# EAGLE design ivo_A_v1_1 (EAGLE 9.6.2)

## Sheet 1 of 3: Audio I/O
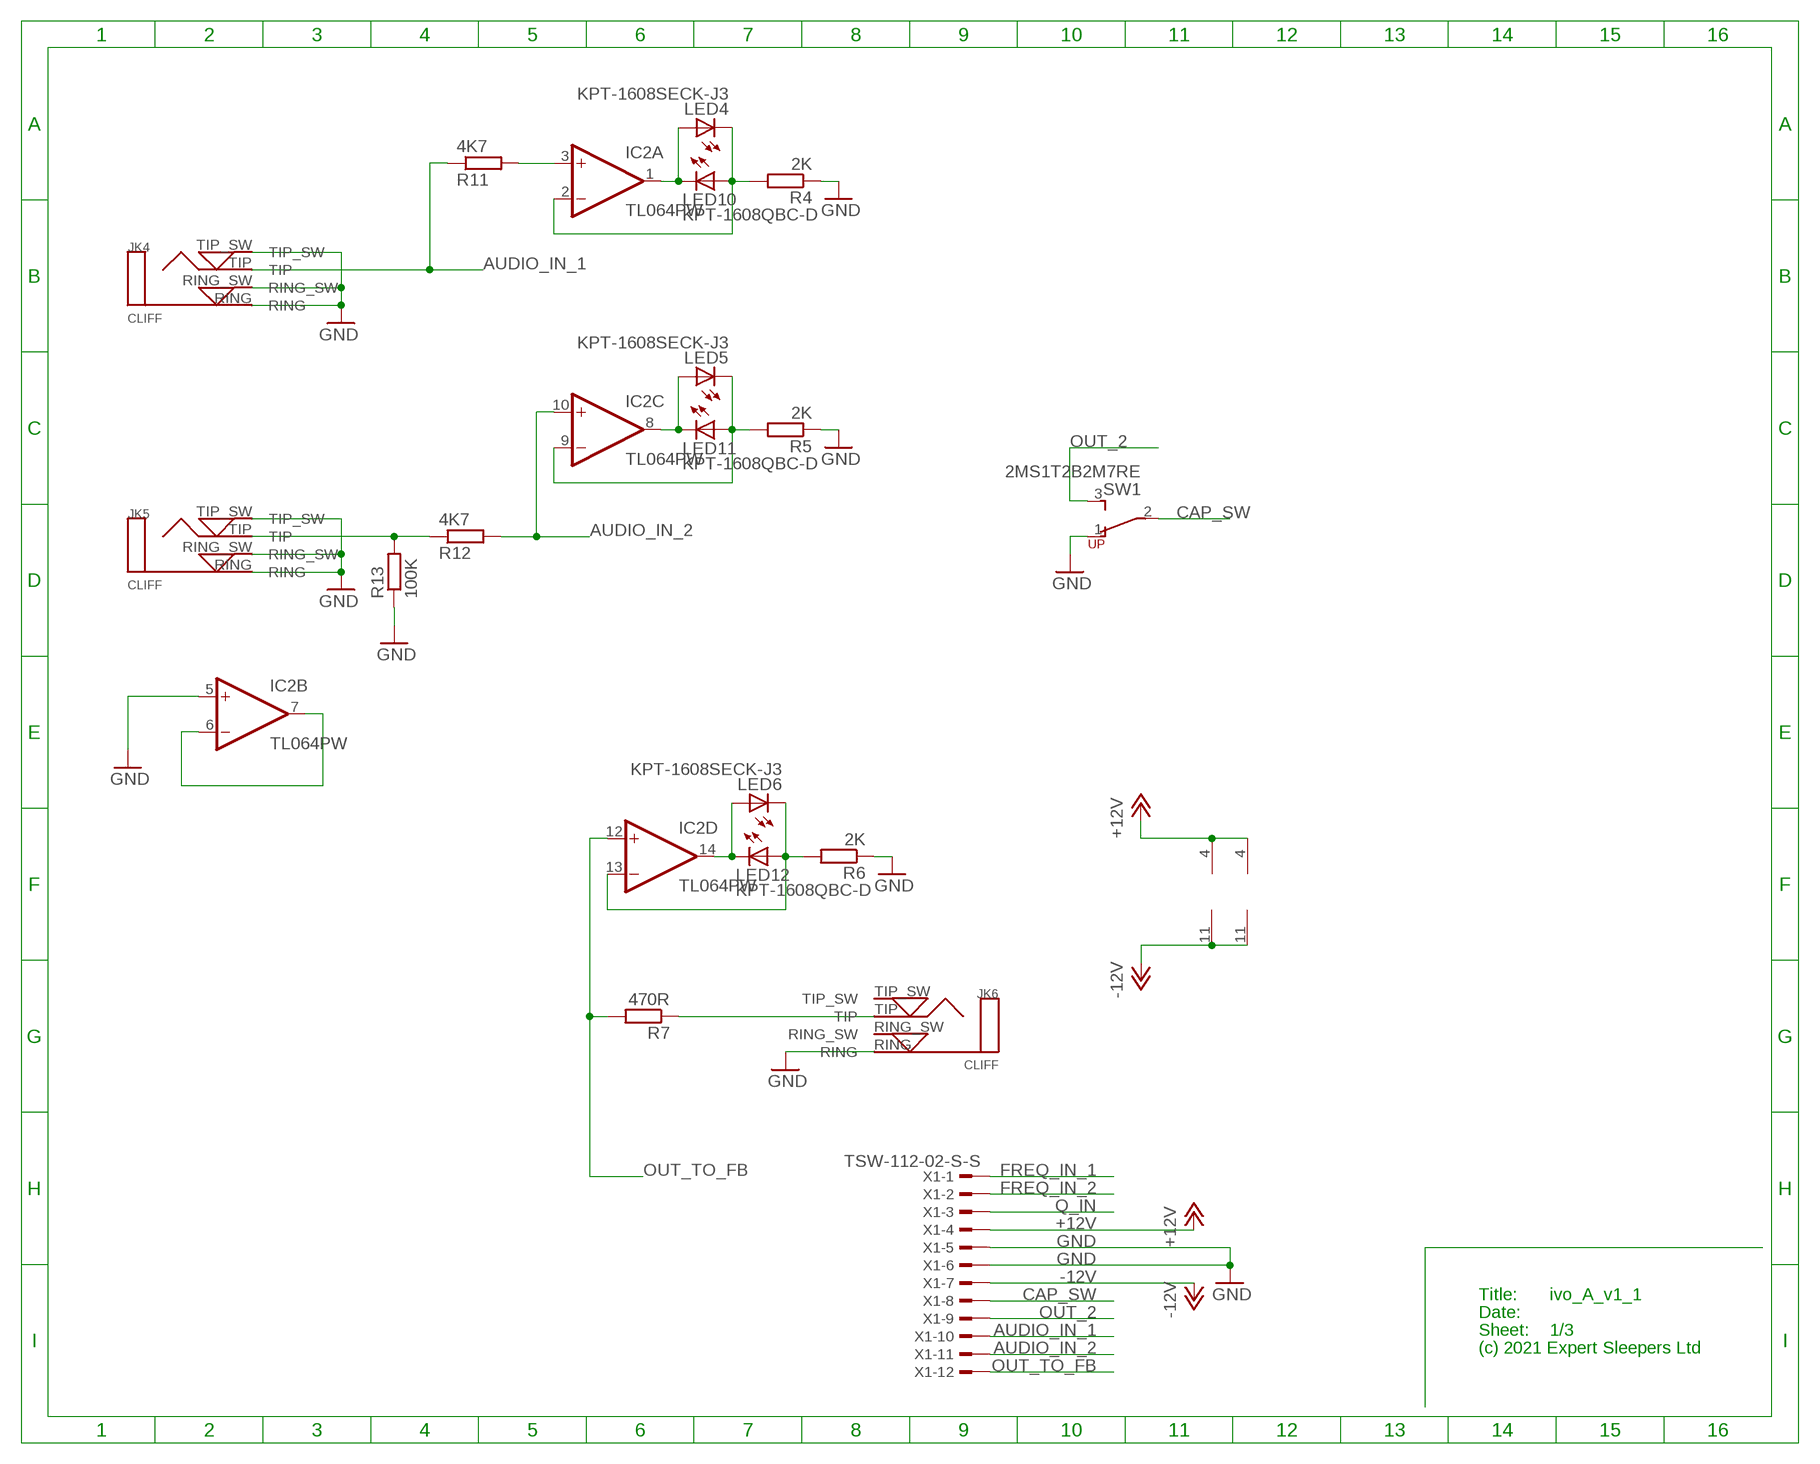
[diagram p0: schematic, sheet 1]

### Parts
IC1  TL064PW  TL074PW  [PW_R-PDSO-G14]
IC2  TL064PW  TL074PW  [PW_R-PDSO-G14]
JK4  CLIFF  CLIFF3.5MM_PCB_SW_JK  [CLIFF3.5MMPCB]
JK5  CLIFF  CLIFF3.5MM_PCB_SW_JK  [CLIFF3.5MMPCB]
JK6  CLIFF  CLIFF3.5MM_PCB_SW_JK  [CLIFF3.5MMPCB]
LED4  KPT-1608SECK-J3  [CHIPLED_0603_LEFT]
LED5  KPT-1608SECK-J3  [CHIPLED_0603_LEFT]
LED6  KPT-1608SECK-J3  [CHIPLED_0603_LEFT]
LED10  KPT-1608QBC-D  [CHIPLED_0603_RIGHT]
LED11  KPT-1608QBC-D  [CHIPLED_0603_RIGHT]
LED12  KPT-1608QBC-D  [CHIPLED_0603_RIGHT]
R4  2K  R-EU_R1206  [R1206]
R5  2K  R-EU_R1206  [R1206]
R6  2K  R-EU_R1206  [R1206]
R7  470R  R-EU_R1206  [R1206]
R11  4K7  R-EU_R1206  [R1206]
R12  4K7  R-EU_R1206  [R1206]
R13  100K  R-EU_R0603  [R0603]
SW1  2MS1T2B2M7RE  [2MS1T2B2M7RE]
X1  TSW-112-02-S-S  [TSW-112-02-S-S]

### Nets
+12V: IC1.4(P:V+) IC2.4(P:V+) X1.4
-12V: IC1.11(P:V-) IC2.11(P:V-) X1.7
AUDIO_IN_1: JK4.TIP R11.1 X1.10
AUDIO_IN_2: IC2.10(C:+IN) R12.2 X1.11
CAP_SW: SW1.2(PR) X1.8
FREQ_IN_1: X1.1 ; also sheet 3
FREQ_IN_2: X1.2 ; also sheet 3
GND [power]: IC2.5(B:+IN) JK4.RING JK4.RING_SW JK4.TIP_SW JK5.RING JK5.RING_SW JK5.TIP_SW JK6.RING R4.1 R5.1 R6.1 R13.1 SW1.1(RU) X1.5 X1.6 ; also sheet 2,3
N$2: IC2.6(B:-IN) IC2.7(B:OUT)
N$47: IC2.3(A:+IN) R11.2
N$62: IC2.8(C:OUT) LED5.2(A) LED11.2(C)
N$63: IC2.9(C:-IN) LED5.1(C) LED11.1(A) R5.2
N$65: IC2.14(D:OUT) LED6.2(A) LED12.2(C)
N$66: IC2.13(D:-IN) LED6.1(C) LED12.1(A) R6.2
N$71: IC2.1(A:OUT) LED4.2(A) LED10.2(C)
N$72: IC2.2(A:-IN) LED4.1(C) LED10.1(A) R4.2
N$75: JK5.TIP R12.1 R13.2
N$76: JK6.TIP R7.1
OUT_2: SW1.3(RD) X1.9
OUT_TO_FB: IC2.12(D:+IN) R7.2 X1.12
Q_IN: X1.3 ; also sheet 2
Unconnected: JK6.RING_SW JK6.TIP_SW

### Notes on the sheet
- Title:
- Date:
- Sheet:
- (c) 2021 Expert Sleepers Ltd

## Sheet 2 of 3: Feedback
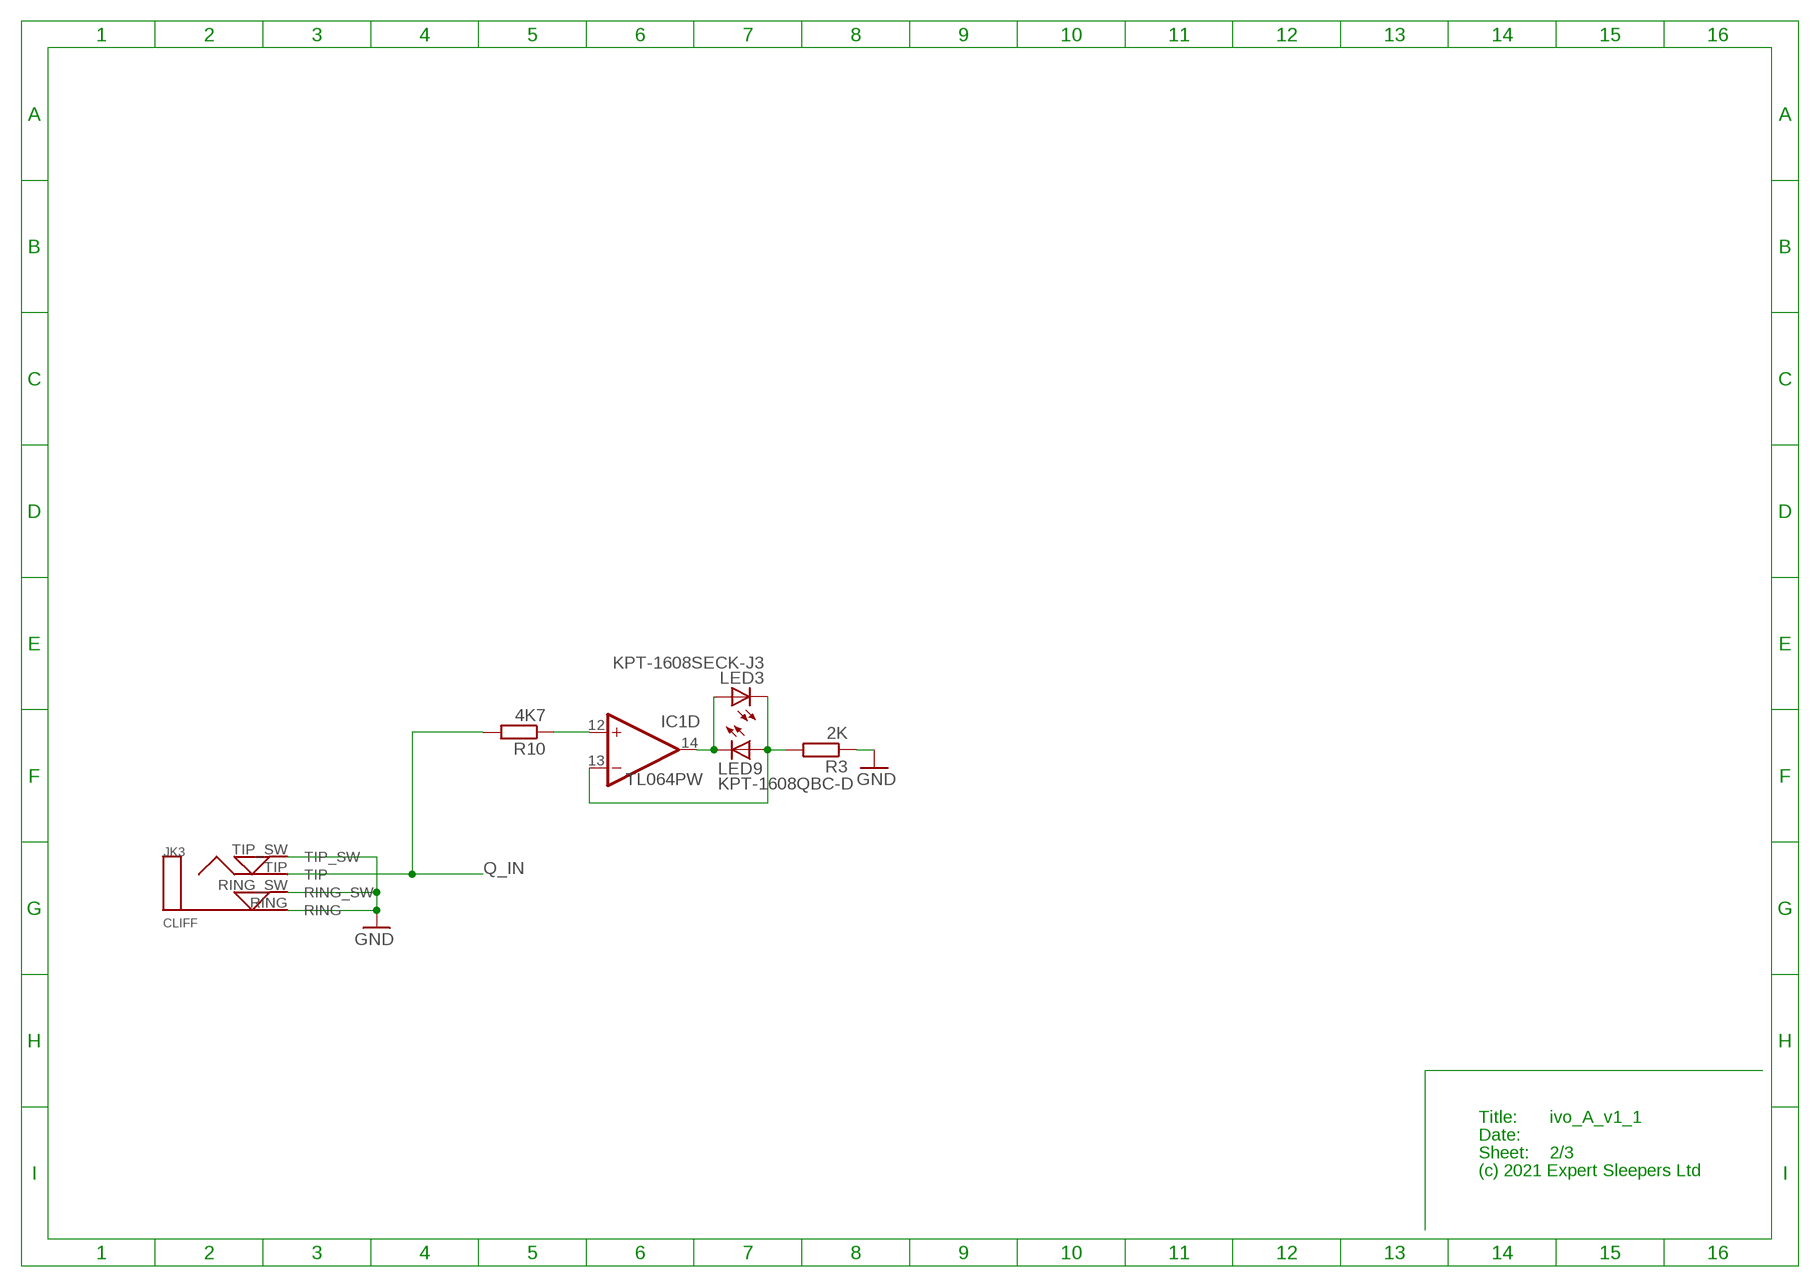
[diagram p1: schematic, sheet 2]

### Parts
JK3  CLIFF  CLIFF3.5MM_PCB_SW_JK  [CLIFF3.5MMPCB]
LED3  KPT-1608SECK-J3  [CHIPLED_0603_LEFT]
LED9  KPT-1608QBC-D  [CHIPLED_0603_RIGHT]
R3  2K  R-EU_R1206  [R1206]
R10  4K7  R-EU_R1206  [R1206]

### Nets
GND [power]: JK3.RING JK3.RING_SW JK3.TIP_SW R3.1 ; also sheet 1,3
N$6: IC1.12(D:+IN) R10.1
N$8: IC1.14(D:OUT) LED3.2(A) LED9.2(C)
N$17: IC1.13(D:-IN) LED3.1(C) LED9.1(A) R3.2
Q_IN: JK3.TIP R10.2 ; also sheet 1

### Notes on the sheet
- Title:
- Date:
- Sheet:
- (c) 2021 Expert Sleepers Ltd

## Sheet 3 of 3: Frequency control
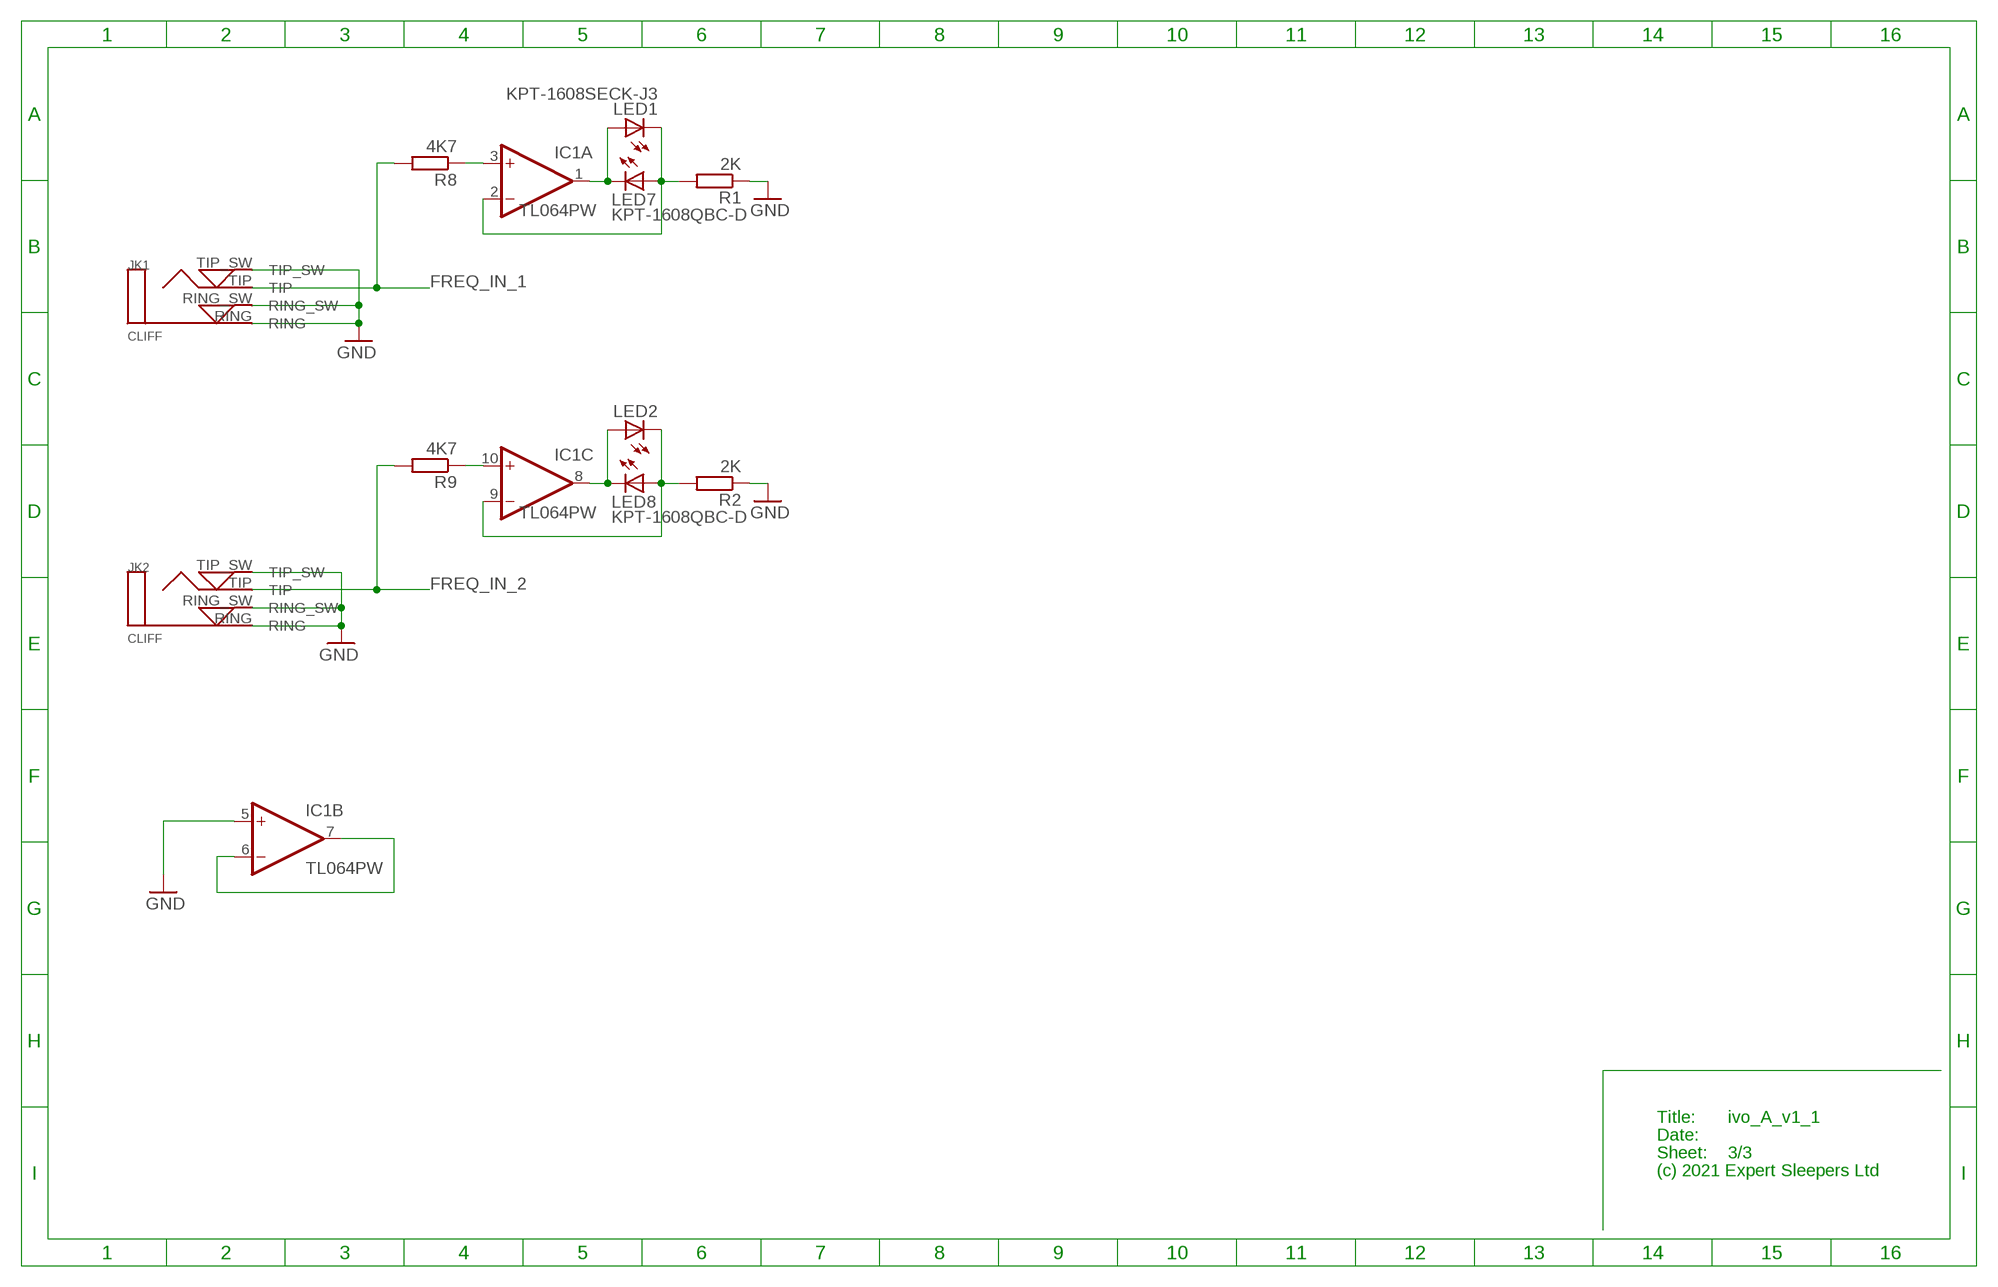
[diagram p2: schematic, sheet 3]

### Parts
JK1  CLIFF  CLIFF3.5MM_PCB_SW_JK  [CLIFF3.5MMPCB]
JK2  CLIFF  CLIFF3.5MM_PCB_SW_JK  [CLIFF3.5MMPCB]
LED1  KPT-1608SECK-J3  [CHIPLED_0603_LEFT]
LED2  KPT-1608SECK-J3  [CHIPLED_0603_LEFT]
LED7  KPT-1608QBC-D  [CHIPLED_0603_RIGHT]
LED8  KPT-1608QBC-D  [CHIPLED_0603_RIGHT]
R1  2K  R-EU_R1206  [R1206]
R2  2K  R-EU_R1206  [R1206]
R8  4K7  R-EU_R1206  [R1206]
R9  4K7  R-EU_R1206  [R1206]

### Nets
FREQ_IN_1: JK1.TIP R8.2 ; also sheet 1
FREQ_IN_2: JK2.TIP R9.2 ; also sheet 1
GND [power]: IC1.5(B:+IN) JK1.RING JK1.RING_SW JK1.TIP_SW JK2.RING JK2.RING_SW JK2.TIP_SW R1.1 R2.1 ; also sheet 1,2
N$4: IC1.6(B:-IN) IC1.7(B:OUT)
N$16: IC1.10(C:+IN) R9.1
N$19: IC1.1(A:OUT) LED1.2(A) LED7.2(C)
N$22: IC1.2(A:-IN) LED1.1(C) LED7.1(A) R1.2
N$25: IC1.3(A:+IN) R8.1
N$29: IC1.8(C:OUT) LED2.2(A) LED8.2(C)
N$30: IC1.9(C:-IN) LED2.1(C) LED8.1(A) R2.2

### Notes on the sheet
- Title:
- Date:
- Sheet:
- (c) 2021 Expert Sleepers Ltd

## Library data of the parts
IC1 IC2 = digital-audio:TL074: OP AMP
JK1-JK6 = cliff:CLIFF3.5MM_PCB_SW_JK: Cliff 3.5mm Mono PCB switched jack socket
LED1-LED6 = kingbright:KPT-1608SECK-J3
LED7-LED12 = kingbright:KPT-1608QBC-D
R1-R13 = rcl:R-EU_: RESISTOR, European symbol
SW1 = switch-multicomp:2MS1T2B2M7RE
X1 = con-samtec:TSW-112-02-S-S: THROUGH-HOLE .025" SQ POST HEADER Source: Samtec TSW.pdf; OC_FARNELL: unknown; OC_NEWARK: unknown

## Board
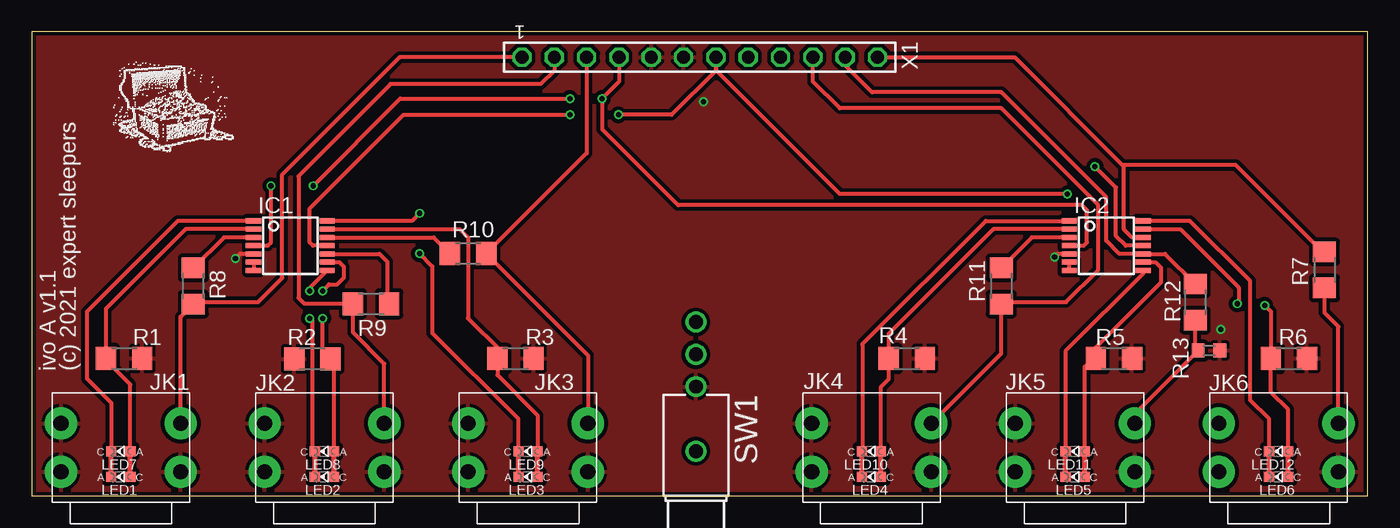
[diagram p3: board, top side]
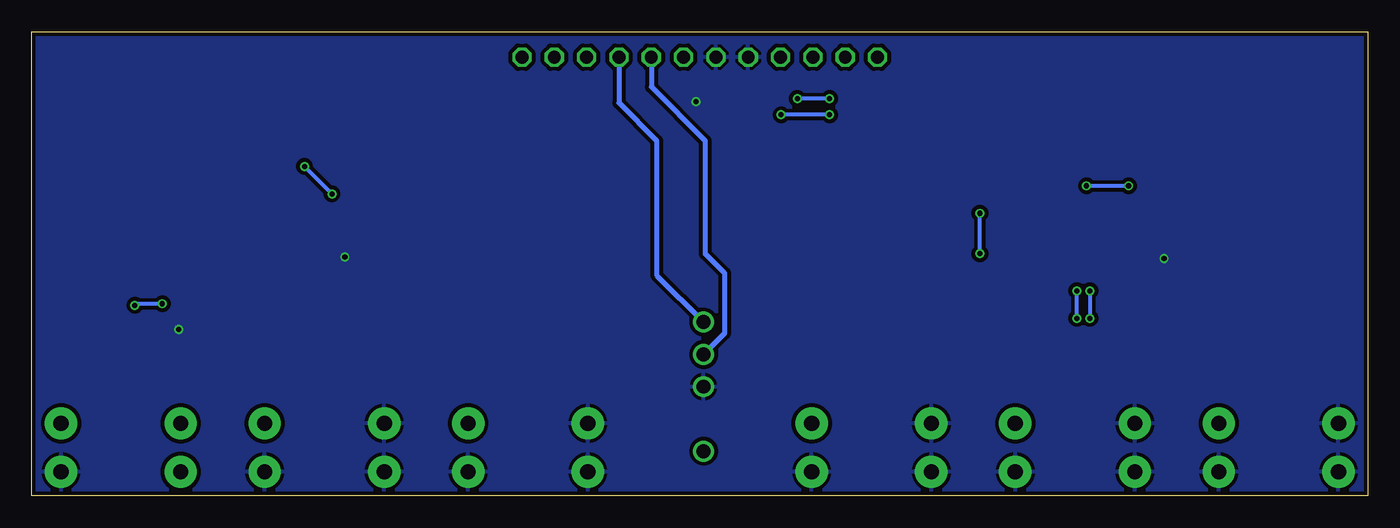
[diagram p4: board, bottom side, seen from below]

Size 105 x 36.5 mm. Coordinates in mm from the lower left corner, seen from the top.
Outline: 0,0 105,0 105,36.5 0,36.5 0,0
Copper layers (1*16): Top 0.035mm / dielectric 1.5mm / Bottom 0.035mm
Design rules "pcbtrain *": minimum track width 0.125mm, minimum drill 0.3mm, track to track 0.125mm, track to pad 0.125mm, pad to pad 0.125mm, via to via 0.125mm, smd to smd 0.125mm, copper to edge 0.25mm, drill to drill 8mil, minimum pad ring 0.15mm, minimum via ring 0.15mm, stop-mask expansion 4mil, vias tented up to drill 0mil, thermal gap 10mil

### Footprints (pad centres in the part's own frame; a part is rotated, then mirrored left to right if it is on the bottom)
PW_R-PDSO-G14 = smd 0.4 x 1.2: 1 -1.95,-2.9; 2 -1.3,-2.9; 3 -0.65,-2.9; 4 0,-2.9; 5 0.65,-2.9; 6 1.3,-2.9; 7 1.95,-2.9; 8 1.95,2.9; 9 1.3,2.9; 10 0.65,2.9; 11 0,2.9; 12 -0.65,2.9; 13 -1.3,2.9; 14 -1.95,2.9
CLIFF3.5MMPCB = drill 1.2 pad 2.54: RING 4.7,-1.9; RING_SW -4.7,-1.9; TIP 4.7,1.9; TIP_SW -4.7,1.9
CHIPLED_0603_LEFT = smd 0.8 x 0.8: 1 0,-0.75; 2 0,0.75
CHIPLED_0603_RIGHT = smd 0.8 x 0.8: 1 0,-0.75; 2 0,0.75
R1206 = smd 1.6 x 1.803: 1 -1.422,0; 2 1.422,0
R0603 = smd 1 x 1.1: 1 -0.85,0; 2 0.85,0
2MS1T2B2M7RE = drill 1.092: 1 0,5.08; 2 0,7.62; 3 0,10.16; 7 0,0
TSW-112-02-S-S = drill 1 pad 1.5 octagon: 1 13.97,0; 2 11.43,0; 3 8.89,0; 4 6.35,0; 5 3.81,0; 6 1.27,0; 7 -1.27,0; 8 -3.81,0; 9 -6.35,0; 10 -8.89,0; 11 -11.43,0; 12 -13.97,0

### Placement (x,y rotation side)
IC1  20.32,19.68 270 top
IC2  84.45,19.68 270 top
JK1  7,3.8 0 top
JK2  23,3.8 0 top
JK3  39,3.8 0 top
JK4  66,3.8 0 top
JK5  82,3.8 0 top
JK6  98,3.8 0 top
LED1  7,1.5 90 top
LED2  23,1.5 90 top
LED3  39,1.5 90 top
LED4  66,1.5 90 top
LED5  82,1.5 90 top
LED6  98,1.5 90 top
LED7  7,3.5 90 top
LED8  23,3.5 90 top
LED9  39,3.5 90 top
LED10  66,3.5 90 top
LED11  82,3.5 90 top
LED12  98,3.5 90 top
R1  7.25,10.81 180 top
R2  22.05,10.78 0 top
R3  38.02,10.81 180 top
R4  68.77,10.81 180 top
R5  85.06,10.81 180 top
R6  98.81,10.81 180 top
R7  101.6,17.78 90 top
R8  12.7,16.51 270 top
R9  26.66,15.11 180 top
R10  34.29,19.05 0 top
R11  76.2,16.51 90 top
R12  91.44,15.24 90 top
R13  92.52,11.42 180 top
SW1  52.2,3.51 0 top
U$1  [TREASURE_10MM_300DPI]  6,27 0 top
X1  52.5,34.5 180 top

### Tracks (layer width: path | path; a pad name or v marks a point on that pad's centre or on a via)
+12V  (via drill 0.4)
  Top 0.305: IC1.4 18.54,19.68 18.8,19.94 v18.8,24.38 | v22.1,24.38 28.96,31.24 v42.29,31.24 | IC2.4 82.68,19.68 82.93,19.94 82.93,22.48 82.55,22.86 50.8,22.86 44.83,28.83 v44.83,31.24 46.15,32.56 X1.4
  Bottom 0.305: v18.8,24.38 v22.1,24.38 | v42.29,31.24 v44.83,31.24
-12V  (via drill 0.4)
  Top 0.305: IC1.11 22.1,19.68 21.84,19.94 21.84,22.61 29.21,29.97 v42.29,29.97 | v46.1,29.97 50.29,29.97 53.77,33.45 X1.7 53.77,33.48 63.5,23.75 v81.41,23.75 | IC2.11 85.98,19.68 85.22,20.45 85.22,24.26 v83.57,25.91
  Bottom 0.305: v42.29,29.97 v46.1,29.97 | v83.57,25.91 v81.41,23.75
AUDIO_IN_1
  Top 0.305: X1.10 61.39,32.59 63.5,30.48 76.2,30.48 83.82,22.86 83.82,17.78 81.28,15.24 76.35,15.24 R11.1 76.2,11.2 JK4.TIP
AUDIO_IN_2
  Top 0.305: R12.2 89.07,19.04 IC2.10 85.49,19.04 84.45,20.07 84.45,23.5 76.2,31.75 66.04,31.75 63.93,33.86 X1.11
CAP_SW
  Bottom 0.406: SW1.2 50.55,12.78 50.55,17.53 52.07,19.05 52.07,27.94 56.31,32.18 X1.8
FREQ_IN_1
  Top 0.305: JK1.TIP 11.7,14.09 R8.2 12.85,15.24 17.78,15.24 19.68,17.14 19.68,25.27 28.91,34.5 X1.1
FREQ_IN_2
  Top 0.305: X1.2 41.07,33.45 40.01,32.38 28.19,32.38 20.95,25.15 20.95,15.58 21.43,15.11 R9.2 25.24,12.86 27.7,10.4 JK2.TIP
GND  (via drill 0.4)
  Top 0.305: IC2.5 80.63,19.04 v80.39,18.8 | IC1.5 16.37,19.04 v16,18.67
  other vias: 93.44,13.09 52.8,30.99
  pour Top (isolate 0.305): 0,0 105,0 105,36.5 0,36.5
  pour Bottom (isolate 0.305): 0,0 105,0 105,36.5 0,36.5
N$2
  Top 0.305: IC2.7 IC2.6
N$4
  Top 0.305: IC1.6 IC1.7
N$6
  Top 0.305: IC1.12 31.58,20.34 R10.1
N$8  (via drill 0.4)
  Top 0.305: LED9.2 38.25,6.04 31.48,12.81 31.48,18.05 v30.48,19.05 | v30.48,22.23 29.89,21.64 IC1.14
  Top 0.406: LED3.2 LED9.2
  Bottom 0.305: v30.48,19.05 v30.48,22.23
N$16
  Top 0.305: R9.1 27.94,15.25 27.94,18.41 27.32,19.04 IC1.10
N$17
  Top 0.305: IC1.13 33.62,20.98 34.29,20.32 34.29,13.97 36.83,11.43 36.83,10.39 36.6,10.16 | R3.2 36.6,10.16 | 36.6,10.16 36.6,9.5 39.75,6.35 LED9.1
  Top 0.406: LED3.1 LED9.1
N$19
  Top 0.305: IC1.1 11.47,21.64 4.32,14.48 4.32,9.24 6.25,7.31 LED7.2
  Top 0.406: LED1.2 LED7.2
N$22
  Top 0.305: LED7.1 7.75,8.76 6.35,10.16 | IC1.2 12.1,20.98 5.83,14.72 R1.2
  Top 0.406: LED1.1 LED7.1 | 6.35,10.16 6.35,10.29 R1.2
N$25
  Top 0.305: IC1.3 15.1,20.34 R8.1
N$29  (via drill 0.4)
  Top 0.305: IC1.8 21.84,16.36 v21.84,16.13 | LED8.2 22.05,3.7 22.05,13.76 v21.84,13.97
  Top 0.406: LED2.2 LED8.2
  Bottom 0.305: v21.84,16.13 v21.84,13.97
N$30  (via drill 0.4)
  Top 0.305: LED8.1 23.75,9.94 R2.2 22.86,11.39 v22.86,13.97 | v22.86,16.13 23.37,16.64 24,16.64 24.51,17.14 24.51,18.03 24.16,18.39 IC1.9
  Top 0.406: LED2.1 LED8.1
  Bottom 0.305: v22.86,13.97 v22.86,16.13
N$47
  Top 0.305: IC2.3 78.6,20.34 R11.2
N$62
  Top 0.305: IC2.8 87.36,17.5 81.25,11.4 LED11.2
  Top 0.406: LED5.2 LED11.2
N$63
  Top 0.305: IC2.9 88.3,18.39 88.77,17.91 88.77,16.82 83.64,11.68 R5.2 83.25,10.65 82.75,10.15 LED11.1
  Top 0.406: LED5.1 LED11.1
N$65
  Top 0.305: LED12.2 97.25,6.04 95.76,7.53 95.76,16.89 91.01,21.64 IC2.14
  Top 0.406: LED6.2 LED12.2
N$66  (via drill 0.4)
  Top 0.305: IC2.13 90.27,20.98 94.87,16.38 94.87,15.24 v94.74,15.11 | v96.9,14.99 97.38,14.5 R6.2 97.38,8.15 98.75,6.79 LED12.1
  Top 0.406: LED6.1 LED12.1
  Bottom 0.305: v94.74,15.11 96.77,15.11 v96.9,14.99
N$71
  Top 0.305: LED10.2 65.28,3.53 65.28,11.94 74.97,21.64 IC2.1
  Top 0.406: LED4.2 LED10.2
N$72
  Top 0.305: IC2.2 75.59,20.98 67.35,12.74 R4.2 67.35,9.18 66.75,8.58 LED10.1
  Top 0.406: LED4.1 LED10.1
N$75
  Top 0.305: JK5.TIP 86.7,6.46 R13.2 91.44,11.65 R12.1
N$76
  Top 0.305: JK6.TIP 102.7,13.32 101.6,14.42 R7.1
OUT_2
  Bottom 0.406: X1.9 58.85,30.91 55.88,27.94 55.88,17.35 SW1.3
OUT_TO_FB
  Top 0.305: R7.2 101.45,19.2 94.61,26.04 85.85,26.04 | IC2.12 86.47,20.34 85.85,20.95 85.85,26.04 | 85.85,26.04 85.72,26.04 77.26,34.5 X1.12
Q_IN
  Top 0.305: X1.3 43.61,26.95 R10.2 43.7,11.06 JK3.TIP

### Text on the board
tPlace: ivo A v1.1 | (c) 2021 expert sleepers